# EAGLE design nandboard (EAGLE 7.7.0)
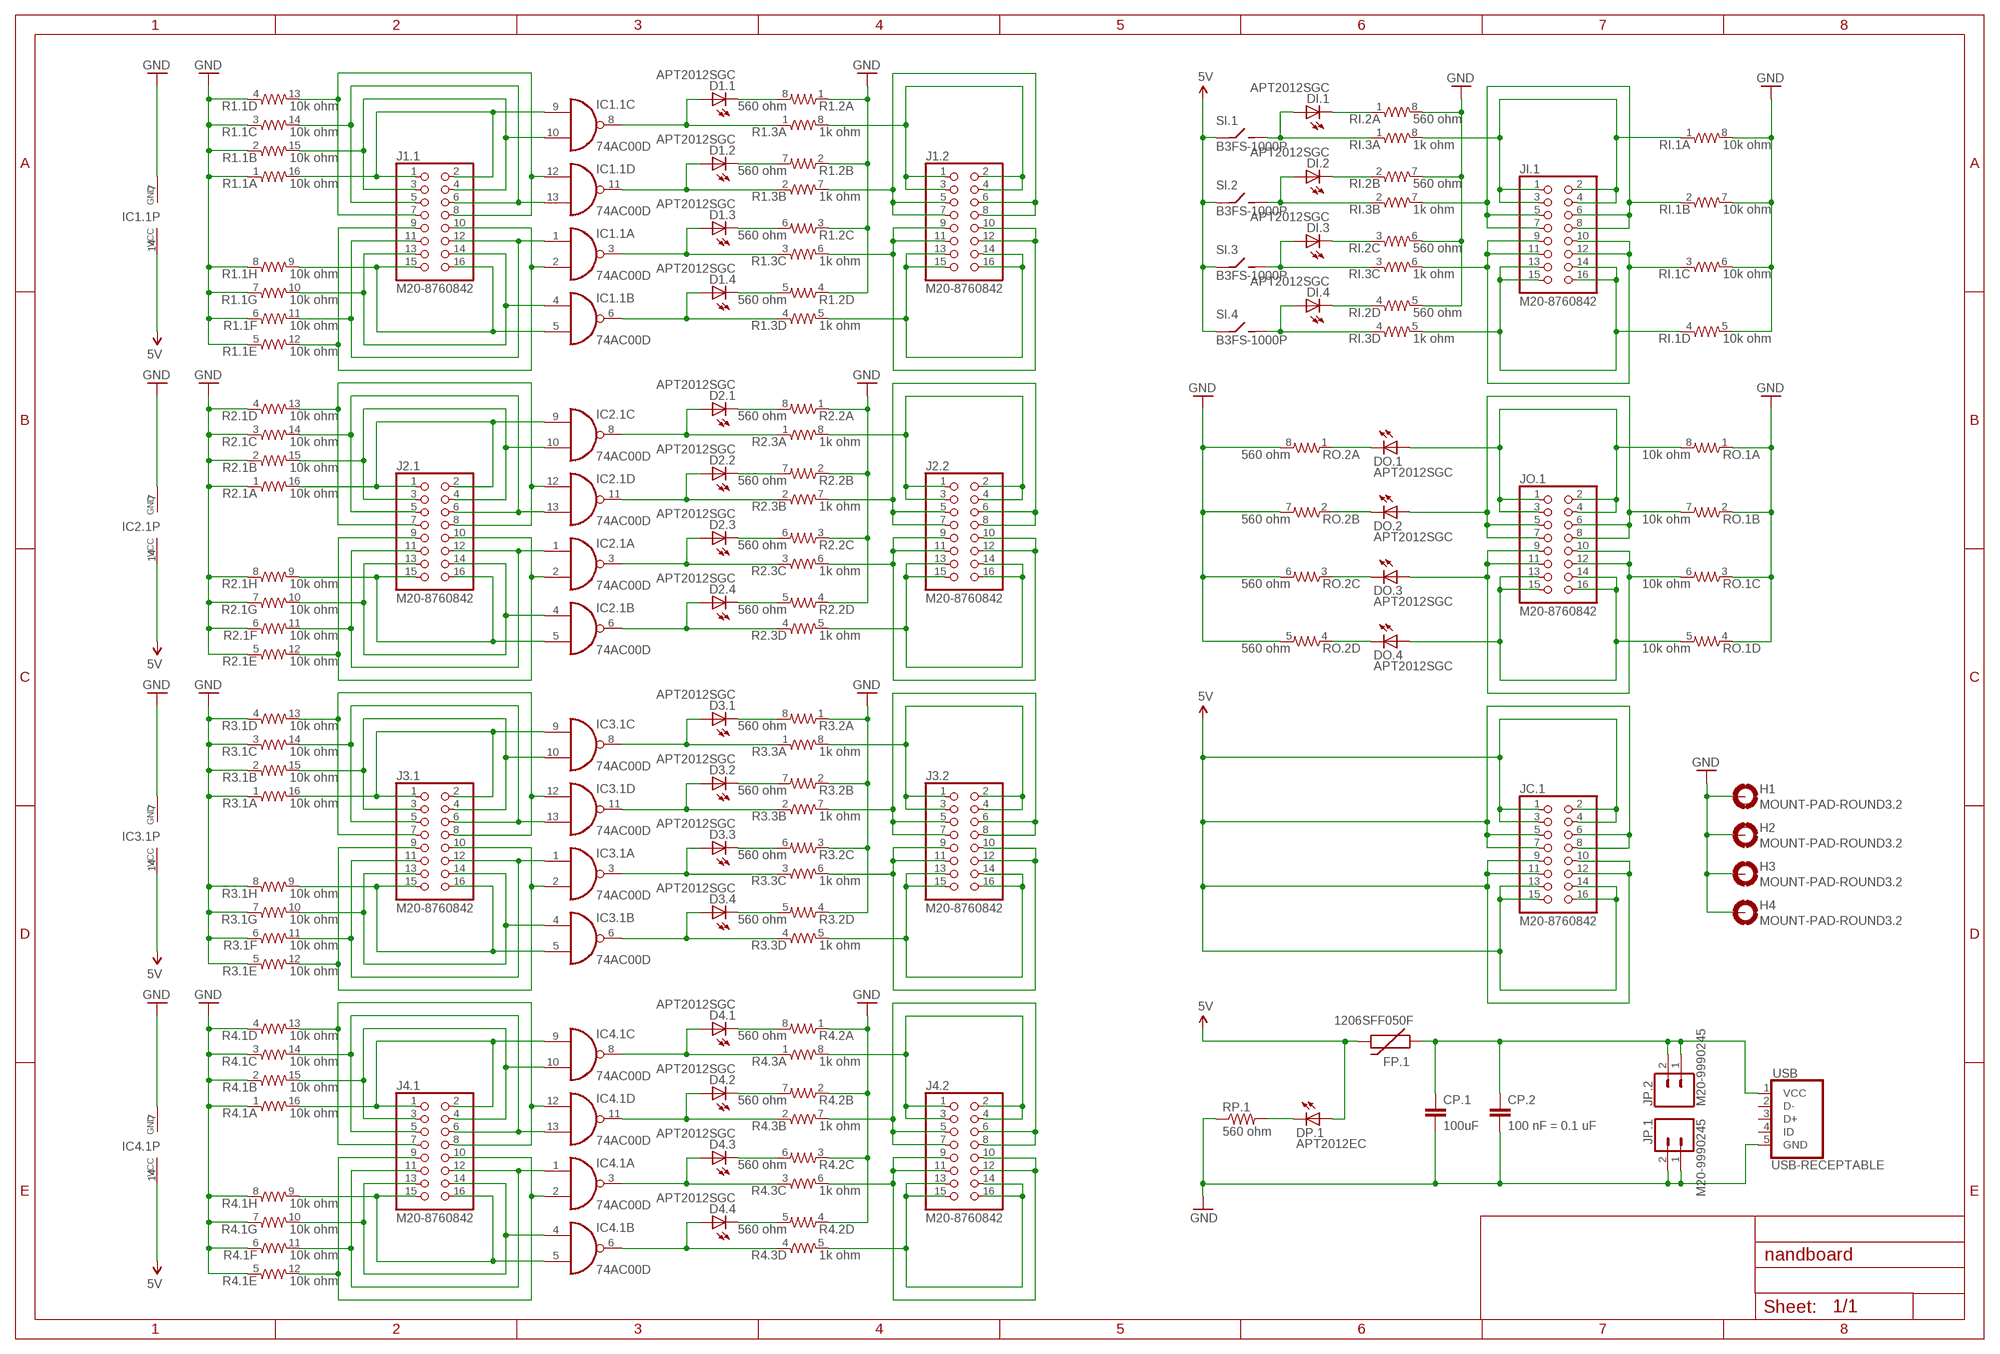
[diagram p0: schematic, sheet 1]

## Parts
CP.1  100uF  C-EUC1210  [C1210]
CP.2  100 nF = 0.1 uF  C-EUC0805  [C0805]
D1.1  APT2012SGC  LEDCHIPLED_0805  [CHIPLED_0805]
D1.2  APT2012SGC  LEDCHIPLED_0805  [CHIPLED_0805]
D1.3  APT2012SGC  LEDCHIPLED_0805  [CHIPLED_0805]
D1.4  APT2012SGC  LEDCHIPLED_0805  [CHIPLED_0805]
D2.1  APT2012SGC  LEDCHIPLED_0805  [CHIPLED_0805]
D2.2  APT2012SGC  LEDCHIPLED_0805  [CHIPLED_0805]
D2.3  APT2012SGC  LEDCHIPLED_0805  [CHIPLED_0805]
D2.4  APT2012SGC  LEDCHIPLED_0805  [CHIPLED_0805]
D3.1  APT2012SGC  LEDCHIPLED_0805  [CHIPLED_0805]
D3.2  APT2012SGC  LEDCHIPLED_0805  [CHIPLED_0805]
D3.3  APT2012SGC  LEDCHIPLED_0805  [CHIPLED_0805]
D3.4  APT2012SGC  LEDCHIPLED_0805  [CHIPLED_0805]
D4.1  APT2012SGC  LEDCHIPLED_0805  [CHIPLED_0805]
D4.2  APT2012SGC  LEDCHIPLED_0805  [CHIPLED_0805]
D4.3  APT2012SGC  LEDCHIPLED_0805  [CHIPLED_0805]
D4.4  APT2012SGC  LEDCHIPLED_0805  [CHIPLED_0805]
DI.1  APT2012SGC  LEDCHIPLED_0805  [CHIPLED_0805]
DI.2  APT2012SGC  LEDCHIPLED_0805  [CHIPLED_0805]
DI.3  APT2012SGC  LEDCHIPLED_0805  [CHIPLED_0805]
DI.4  APT2012SGC  LEDCHIPLED_0805  [CHIPLED_0805]
DO.1  APT2012SGC  LEDCHIPLED_0805  [CHIPLED_0805]
DO.2  APT2012SGC  LEDCHIPLED_0805  [CHIPLED_0805]
DO.3  APT2012SGC  LEDCHIPLED_0805  [CHIPLED_0805]
DO.4  APT2012SGC  LEDCHIPLED_0805  [CHIPLED_0805]
DP.1  APT2012EC  LEDCHIPLED_0805  [CHIPLED_0805]
FP.1  1206SFF050F  PTCSMD  [PTC-1206]
H1  MOUNT-PAD-ROUND3.2  [3,2-PAD]
H2  MOUNT-PAD-ROUND3.2  [3,2-PAD]
H3  MOUNT-PAD-ROUND3.2  [3,2-PAD]
H4  MOUNT-PAD-ROUND3.2  [3,2-PAD]
IC1.1  74AC00D  [SO14]
IC2.1  74AC00D  [SO14]
IC3.1  74AC00D  [SO14]
IC4.1  74AC00D  [SO14]
J1.1  M20-8760842  PINHD-2X8SMT  [2X08_SMT]
J1.2  M20-8760842  PINHD-2X8SMT  [2X08_SMT]
J2.1  M20-8760842  PINHD-2X8SMT  [2X08_SMT]
J2.2  M20-8760842  PINHD-2X8SMT  [2X08_SMT]
J3.1  M20-8760842  PINHD-2X8SMT  [2X08_SMT]
J3.2  M20-8760842  PINHD-2X8SMT  [2X08_SMT]
J4.1  M20-8760842  PINHD-2X8SMT  [2X08_SMT]
J4.2  M20-8760842  PINHD-2X8SMT  [2X08_SMT]
JC.1  M20-8760842  PINHD-2X8SMT  [2X08_SMT]
JI.1  M20-8760842  PINHD-2X8SMT  [2X08_SMT]
JO.1  M20-8760842  PINHD-2X8SMT  [2X08_SMT]
JP.1  M20-9990245  CONN_02  [1X02]
JP.2  M20-9990245  CONN_02  [1X02]
R1.1  10k ohm  742-16_S  [742-16]
R1.2  560 ohm  742-8_S  [742-8]
R1.3  1k ohm  742-8_S  [742-8]
R2.1  10k ohm  742-16_S  [742-16]
R2.2  560 ohm  742-8_S  [742-8]
R2.3  1k ohm  742-8_S  [742-8]
R3.1  10k ohm  742-16_S  [742-16]
R3.2  560 ohm  742-8_S  [742-8]
R3.3  1k ohm  742-8_S  [742-8]
R4.1  10k ohm  742-16_S  [742-16]
R4.2  560 ohm  742-8_S  [742-8]
R4.3  1k ohm  742-8_S  [742-8]
RI.1  10k ohm  742-8_S  [742-8]
RI.2  560 ohm  742-8_S  [742-8]
RI.3  1k ohm  742-8_S  [742-8]
RO.1  10k ohm  742-8_S  [742-8]
RO.2  560 ohm  742-8_S  [742-8]
RP.1  560 ohm  R-US_R0603  [R0603]
SI.1  B3FS-1000P  SPSTB3FS-1000  [B3FS-1000]
SI.2  B3FS-1000P  SPSTB3FS-1000  [B3FS-1000]
SI.3  B3FS-1000P  SPSTB3FS-1000  [B3FS-1000]
SI.4  B3FS-1000P  SPSTB3FS-1000  [B3FS-1000]
USB  USB-RECEPTABLE  [FCI-10103594-0001LF]

## Nets
5V: DP.1.A FP.1.2 IC1.1.14(P:VCC) IC2.1.14(P:VCC) IC3.1.14(P:VCC) IC4.1.14(P:VCC) JC.1.1 JC.1.2 JC.1.3 JC.1.4 JC.1.5 JC.1.6 JC.1.7 JC.1.8 JC.1.9 JC.1.10 JC.1.11 JC.1.12 JC.1.13 JC.1.14 JC.1.15 JC.1.16 SI.1.1(A) SI.1.2(A) SI.2.1(A) SI.2.2(A) SI.3.1(A) SI.3.2(A) SI.4.1(A) SI.4.2(A)
GND: CP.1.2 CP.2.2 H1.B3,2(MOUNT) H2.B3,2(MOUNT) H3.B3,2(MOUNT) H4.B3,2(MOUNT) IC1.1.7(P:GND) IC2.1.7(P:GND) IC3.1.7(P:GND) IC4.1.7(P:GND) JP.1.1 JP.1.2 R1.1.1 R1.1.2 R1.1.3 R1.1.4 R1.1.5 R1.1.6 R1.1.7 R1.1.8 R1.2.1 R1.2.2 R1.2.3 R1.2.4 R2.1.1 R2.1.2 R2.1.3 R2.1.4 R2.1.5 R2.1.6 R2.1.7 R2.1.8 R2.2.1 R2.2.2 R2.2.3 R2.2.4 R3.1.1 R3.1.2 R3.1.3 R3.1.4 R3.1.5 R3.1.6 R3.1.7 R3.1.8 R3.2.1 R3.2.2 R3.2.3 R3.2.4 R4.1.1 R4.1.2 R4.1.3 R4.1.4 R4.1.5 R4.1.6 R4.1.7 R4.1.8 R4.2.1 R4.2.2 R4.2.3 R4.2.4 RI.1.5 RI.1.6 RI.1.7 RI.1.8 RI.2.5 RI.2.6 RI.2.7 RI.2.8 RO.1.1 RO.1.2 RO.1.3 RO.1.4 RO.2.5 RO.2.6 RO.2.7 RO.2.8 RP.1.1 USB.5(GND)
N$1: IC2.1.9(C:I0) J2.1.1 J2.1.2 R2.1.16
N$2: IC2.1.10(C:I1) J2.1.3 J2.1.4 R2.1.15
N$3: JI.1.1 JI.1.2 JI.1.3 JI.1.4 RI.1.1 RI.3.8
N$4: IC2.1.13(D:I1) J2.1.5 J2.1.6 R2.1.14
N$5: IC2.1.12(D:I0) J2.1.7 J2.1.8 R2.1.13
N$6: JI.1.5 JI.1.6 JI.1.7 JI.1.8 RI.1.2 RI.3.7
N$7: JI.1.9 JI.1.10 JI.1.11 JI.1.12 RI.1.3 RI.3.6
N$8: JI.1.13 JI.1.14 JI.1.15 JI.1.16 RI.1.4 RI.3.5
N$9: IC2.1.5(B:I1) J2.1.15 J2.1.16 R2.1.9
N$10: IC2.1.4(B:I0) J2.1.13 J2.1.14 R2.1.10
N$11: IC2.1.1(A:I0) J2.1.11 J2.1.12 R2.1.11
N$12: IC2.1.2(A:I1) J2.1.9 J2.1.10 R2.1.12
N$13: D1.4.C R1.2.5
N$14: D2.1.C R2.2.8
N$15: D2.2.C R2.2.7
N$16: D1.2.C R1.2.7
N$17: J2.2.13 J2.2.14 J2.2.15 J2.2.16 R2.3.5
N$18: J2.2.9 J2.2.10 J2.2.11 J2.2.12 R2.3.6
N$19: J2.2.1 J2.2.2 J2.2.3 J2.2.4 R2.3.8
N$20: J2.2.5 J2.2.6 J2.2.7 J2.2.8 R2.3.7
N$21: IC1.1.9(C:I0) J1.1.1 J1.1.2 R1.1.16
N$22: IC1.1.10(C:I1) J1.1.3 J1.1.4 R1.1.15
N$23: IC1.1.13(D:I1) J1.1.5 J1.1.6 R1.1.14
N$24: IC1.1.12(D:I0) J1.1.7 J1.1.8 R1.1.13
N$25: J1.2.13 J1.2.14 J1.2.15 J1.2.16 R1.3.5
N$26: J1.2.9 J1.2.10 J1.2.11 J1.2.12 R1.3.6
N$27: D1.1.A IC1.1.8(C:O) R1.3.1
N$28: J1.2.1 J1.2.2 J1.2.3 J1.2.4 R1.3.8
N$29: IC1.1.5(B:I1) J1.1.15 J1.1.16 R1.1.9
N$30: IC1.1.4(B:I0) J1.1.13 J1.1.14 R1.1.10
N$31: IC1.1.1(A:I0) J1.1.11 J1.1.12 R1.1.11
N$32: IC1.1.2(A:I1) J1.1.9 J1.1.10 R1.1.12
N$33: D1.2.A IC1.1.11(D:O) R1.3.2
N$34: J1.2.5 J1.2.6 J1.2.7 J1.2.8 R1.3.7
N$35: D1.3.A IC1.1.3(A:O) R1.3.3
N$36: D1.4.A IC1.1.6(B:O) R1.3.4
N$37: D2.1.A IC2.1.8(C:O) R2.3.1
N$38: D2.2.A IC2.1.11(D:O) R2.3.2
N$39: D2.3.A IC2.1.3(A:O) R2.3.3
N$40: D2.4.A IC2.1.6(B:O) R2.3.4
N$41: D1.1.C R1.2.8
N$42: D1.3.C R1.2.6
N$43: D2.3.C R2.2.6
N$44: D2.4.C R2.2.5
N$45: IC3.1.9(C:I0) J3.1.1 J3.1.2 R3.1.16
N$46: IC3.1.10(C:I1) J3.1.3 J3.1.4 R3.1.15
N$47: IC3.1.13(D:I1) J3.1.5 J3.1.6 R3.1.14
N$48: IC3.1.12(D:I0) J3.1.7 J3.1.8 R3.1.13
N$49: IC3.1.5(B:I1) J3.1.15 J3.1.16 R3.1.9
N$50: IC3.1.4(B:I0) J3.1.13 J3.1.14 R3.1.10
N$51: IC3.1.1(A:I0) J3.1.11 J3.1.12 R3.1.11
N$52: IC3.1.2(A:I1) J3.1.9 J3.1.10 R3.1.12
N$53: J3.2.13 J3.2.14 J3.2.15 J3.2.16 R3.3.5
N$54: J3.2.9 J3.2.10 J3.2.11 J3.2.12 R3.3.6
N$55: J3.2.1 J3.2.2 J3.2.3 J3.2.4 R3.3.8
N$56: J3.2.5 J3.2.6 J3.2.7 J3.2.8 R3.3.7
N$57: D3.1.A IC3.1.8(C:O) R3.3.1
N$58: D3.2.A IC3.1.11(D:O) R3.3.2
N$59: D3.3.A IC3.1.3(A:O) R3.3.3
N$60: D3.4.A IC3.1.6(B:O) R3.3.4
N$61: D3.4.C R3.2.5
N$62: D3.3.C R3.2.6
N$63: D3.2.C R3.2.7
N$64: D3.1.C R3.2.8
N$65: IC4.1.9(C:I0) J4.1.1 J4.1.2 R4.1.16
N$66: IC4.1.10(C:I1) J4.1.3 J4.1.4 R4.1.15
N$67: IC4.1.13(D:I1) J4.1.5 J4.1.6 R4.1.14
N$68: IC4.1.12(D:I0) J4.1.7 J4.1.8 R4.1.13
N$69: IC4.1.5(B:I1) J4.1.15 J4.1.16 R4.1.9
N$70: IC4.1.4(B:I0) J4.1.13 J4.1.14 R4.1.10
N$71: IC4.1.1(A:I0) J4.1.11 J4.1.12 R4.1.11
N$72: IC4.1.2(A:I1) J4.1.9 J4.1.10 R4.1.12
N$73: J4.2.13 J4.2.14 J4.2.15 J4.2.16 R4.3.5
N$74: J4.2.9 J4.2.10 J4.2.11 J4.2.12 R4.3.6
N$75: J4.2.1 J4.2.2 J4.2.3 J4.2.4 R4.3.8
N$76: J4.2.5 J4.2.6 J4.2.7 J4.2.8 R4.3.7
N$77: D4.1.A IC4.1.8(C:O) R4.3.1
N$78: D4.2.A IC4.1.11(D:O) R4.3.2
N$79: D4.3.A IC4.1.3(A:O) R4.3.3
N$80: D4.4.A IC4.1.6(B:O) R4.3.4
N$81: D4.1.C R4.2.8
N$82: D4.2.C R4.2.7
N$83: D4.3.C R4.2.6
N$84: D4.4.C R4.2.5
N$85: DO.1.C RO.2.1
N$86: DO.2.C RO.2.2
N$87: DO.3.C RO.2.3
N$88: DO.4.C RO.2.4
N$89: DO.1.A JO.1.1 JO.1.2 JO.1.3 JO.1.4 RO.1.8
N$90: DO.2.A JO.1.5 JO.1.6 JO.1.7 JO.1.8 RO.1.7
N$91: DO.3.A JO.1.9 JO.1.10 JO.1.11 JO.1.12 RO.1.6
N$92: DO.4.A JO.1.13 JO.1.14 JO.1.15 JO.1.16 RO.1.5
N$93: CP.1.1 CP.2.1 FP.1.1 JP.2.1 JP.2.2 USB.1(VCC)
N$94: DI.2.A RI.3.2 SI.2.3(B) SI.2.4(B)
N$95: DI.3.A RI.3.3 SI.3.3(B) SI.3.4(B)
N$96: DI.1.A RI.3.1 SI.1.3(B) SI.1.4(B)
N$97: DI.4.A RI.3.4 SI.4.3(B) SI.4.4(B)
N$98: DI.1.C RI.2.1
N$99: DI.2.C RI.2.2
N$100: DI.3.C RI.2.3
N$101: DI.4.C RI.2.4
N$102: DP.1.C RP.1.2
Unconnected: USB.2(D-) USB.3(D+) USB.4(ID)

## Library data of the parts
CP.1 CP.2 = rcl:C-EU: CAPACITOR, European symbol
D1.1-D1.4 D2.1-D2.4 D3.1-D3.4 D4.1-D4.4 DI.1-DI.4 DO.1-DO.4 DP.1 = led:LED: LED OSRAM: - CHIPLED LG R971, LG N971, LY N971, LG Q971, LY Q971, LO R971, LY R971 LH N974, LH R974 LS Q976, LO Q976, LY Q976 LO Q996 - Hyper CHIPLED LW Q18S LB Q993, LB Q99A, LB R99A - SideLED LS A670, LO A670, LY A670, LG A670, LP A670 LB A673, LV A673, LT A673, LW A673 LH A674 LY A675 LS A676, LA A676, LO A676, LY A676, LW A676 LS A679, LY A679, LG A679 - Hyper Micro SIDELED® LS Y876, LA Y876, LO Y876, LY Y876 LT Y87S - SmartLED LW L88C, LW L88S LB L89C, LB L89S, LG L890 LS L89K, LO L89K, LY L89K LS L896, LA L896, LO L896, LY L896 - TOPLED LS T670, LO T670, LY T670, LG T670, LP T670 LSG T670, LSP T670, LSY T670, LOP T670, LYG T670 LG T671, LOG T671, LSG T671 LB T673, LV T673, LT T673, LW T673 LH T674 LS T676, LA T676, LO T676, LY T676, LB T676, LH T676, LSB T676, LW T676 LB T67C, LV T67C, LT T67C, LS T67K, LO T67K, LY T67K, LW E67C LS E67B, LA E67B, LO E67B, LY E67B, LB E67C, LV E67C, LT E67C LW T67C LS T679, LY T679, LG T679 LS T770, LO T770, LY T770, LG T770, LP T770 LB T773, LV T773, LT T773, LW T773 LH T774 LS E675, LA E675, LY E675, LS T675 LS T776, LA T776, LO T776, LY T776, LB T776 LHGB T686 LT T68C, LB T68C - Hyper Mini TOPLED® LB M676 - Mini TOPLED Santana® LG M470 LS M47K, LO M47K, LY M47K Source: http://www.osram.convergy.de LUXEON: - LUMILED® LXK2-PW12-R00, LXK2-PW12-S00, LXK2-PW14-U00, LXK2-PW14-V00 LXK2-PM12-R00, LXK2-PM12-S00, LXK2-PM14-U00 LXK2-PE12-Q00, LXK2-PE12-R00, LXK2-PE12-S00, LXK2-PE14-T00, LXK2-PE14-U00 LXK2-PB12-K00, LXK2-PB12-L00, LXK2-PB12-M00, LXK2-PB14-N00, LXK2-PB14-P00, LXK2-PB14-Q00 LXK2-PR12-L00, LXK2-PR12-M00, LXK2-PR14-Q00, LXK2-PR14-R00 LXK2-PD12-Q00, LXK2-PD12-R00, LXK2-PD12-S00 LXK2-PH12-R00, LXK2-PH12-S00 LXK2-PL12-P00, LXK2-PL12-Q00, LXK2-PL12-R00 Source: www.luxeon.com KINGBRIGHT: KA-3528ASYC Source: www.kingbright.com
FP.1 = SparkFun-PowerIC:PTC: Resettable Fuse PTC Resettable Fuse. Spark Fun Electronics SKU : COM-08357; PROD_ID: RES-11150
H1-H4 = holes:MOUNT-PAD-ROUND: MOUNTING PAD, round
IC1.1 IC2.1 IC3.1 IC4.1 = 74xx-eu:74*00: Quad 2-input NAND gate
J1.1 J1.2 J2.1 J2.2 J3.1 J3.2 J4.1 J4.2 JC.1 JI.1 JO.1 = pinhead+:PINHD-2X8: PIN HEADER
JP.1 JP.2 = SparkFun-Connectors:CONN_02: Multi connection point. Often used as Generic Header-pin footprint for 0.1 inch spaced/style header connections On any of the 0.1 inch spaced packages, you can populate with these: Break Away Headers - Straight <https://www.sparkfun.com/products/116> (PRT-00116) Break Away Male Headers - Right Angle <https://www.sparkfun.com/products/553> (PRT-00553) Female Headers <https://www.sparkfun.com/products/115> (PRT-00115) Break Away Headers - Machine Pin <https://www.sparkfun.com/products/117> (PRT-00117) Break Away Female Headers - Swiss Machine Pin <https://www.sparkfun.com/products/743> (PRT-00743) For SCREWTERMINALS and SPRING TERMINALS visit here: Screw Terimnals on SparkFun.com <https://www.sparkfun.com/search/results?term=Screw+Terminals> (5mm/3.5mm/2.54mm spacing) This device is also useful as a general connection point to wire up your design to another part of your project. Our various solder wires solder well into these plated through hole pads. Hook-Up Wire - Assortment (Stranded, 22 AWG) <https://www.sparkfun.com/products/11375> (PRT-11375) Hook-Up Wire - Assortment (Solid Core, 22 AWG) <https://www.sparkfun.com/products/11367> (PRT-11367) View the entire wire category on our website here <https://www.sparkfun.com/categories/141> Special notes: Molex polarized connector foot print use with: PRT-08233 with associated crimp pins and housings. 2.54_SCREWTERM for use with PRT-10571. 3.5mm Screw Terminal footprints for PRT-08084 5mm Screw Terminal footprints for use with PRT-08432
R1.1 R2.1 R3.1 R4.1 = resistor-array:742-16_S: CTS 742 Series 16 Terminations, 8 Resistors
R1.2 R1.3 R2.2 R2.3 R3.2 R3.3 R4.2 R4.3 RI.1-RI.3 RO.1 RO.2 = resistor-array:742-8_S: CTS 742 Series 8 Terminations, 4 Resistors
RP.1 = resistor:R-US_: RESISTOR, American symbol
SI.1-SI.4 = PP_Electromechanical:SPST: SPST Switches
USB = daspilker:USB-RECEPTABLE: USB Receptable

## Board
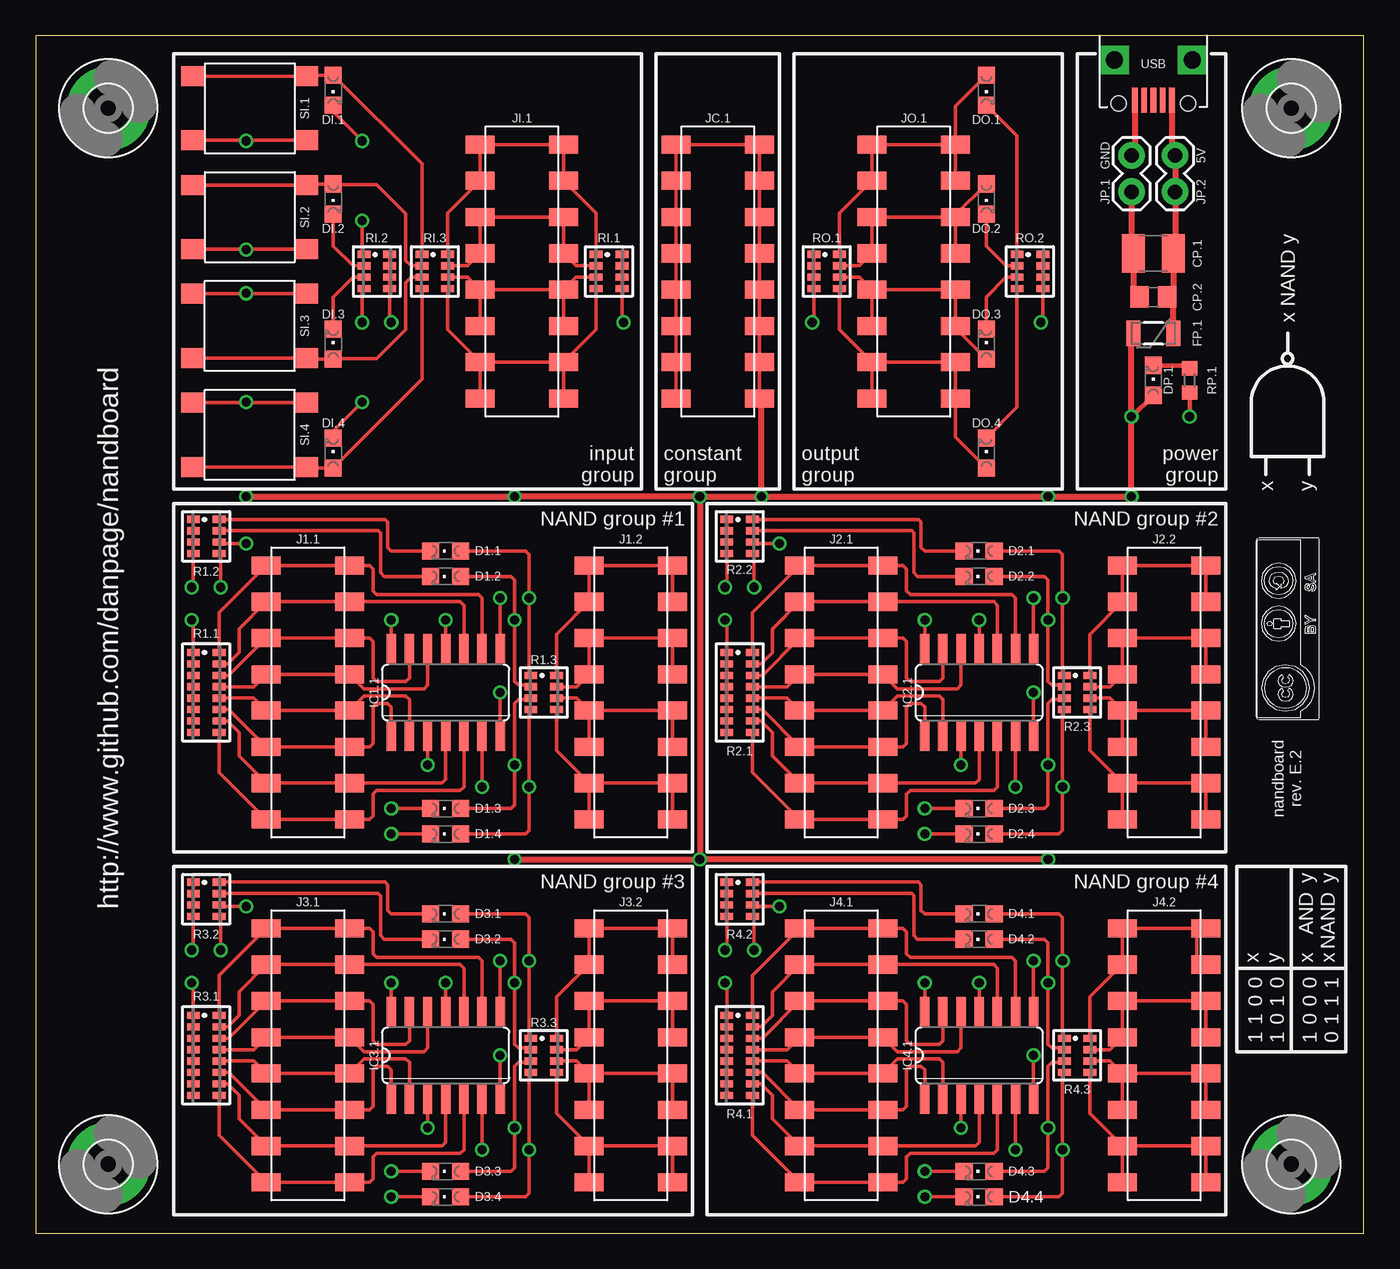
[diagram p1: board, top side]
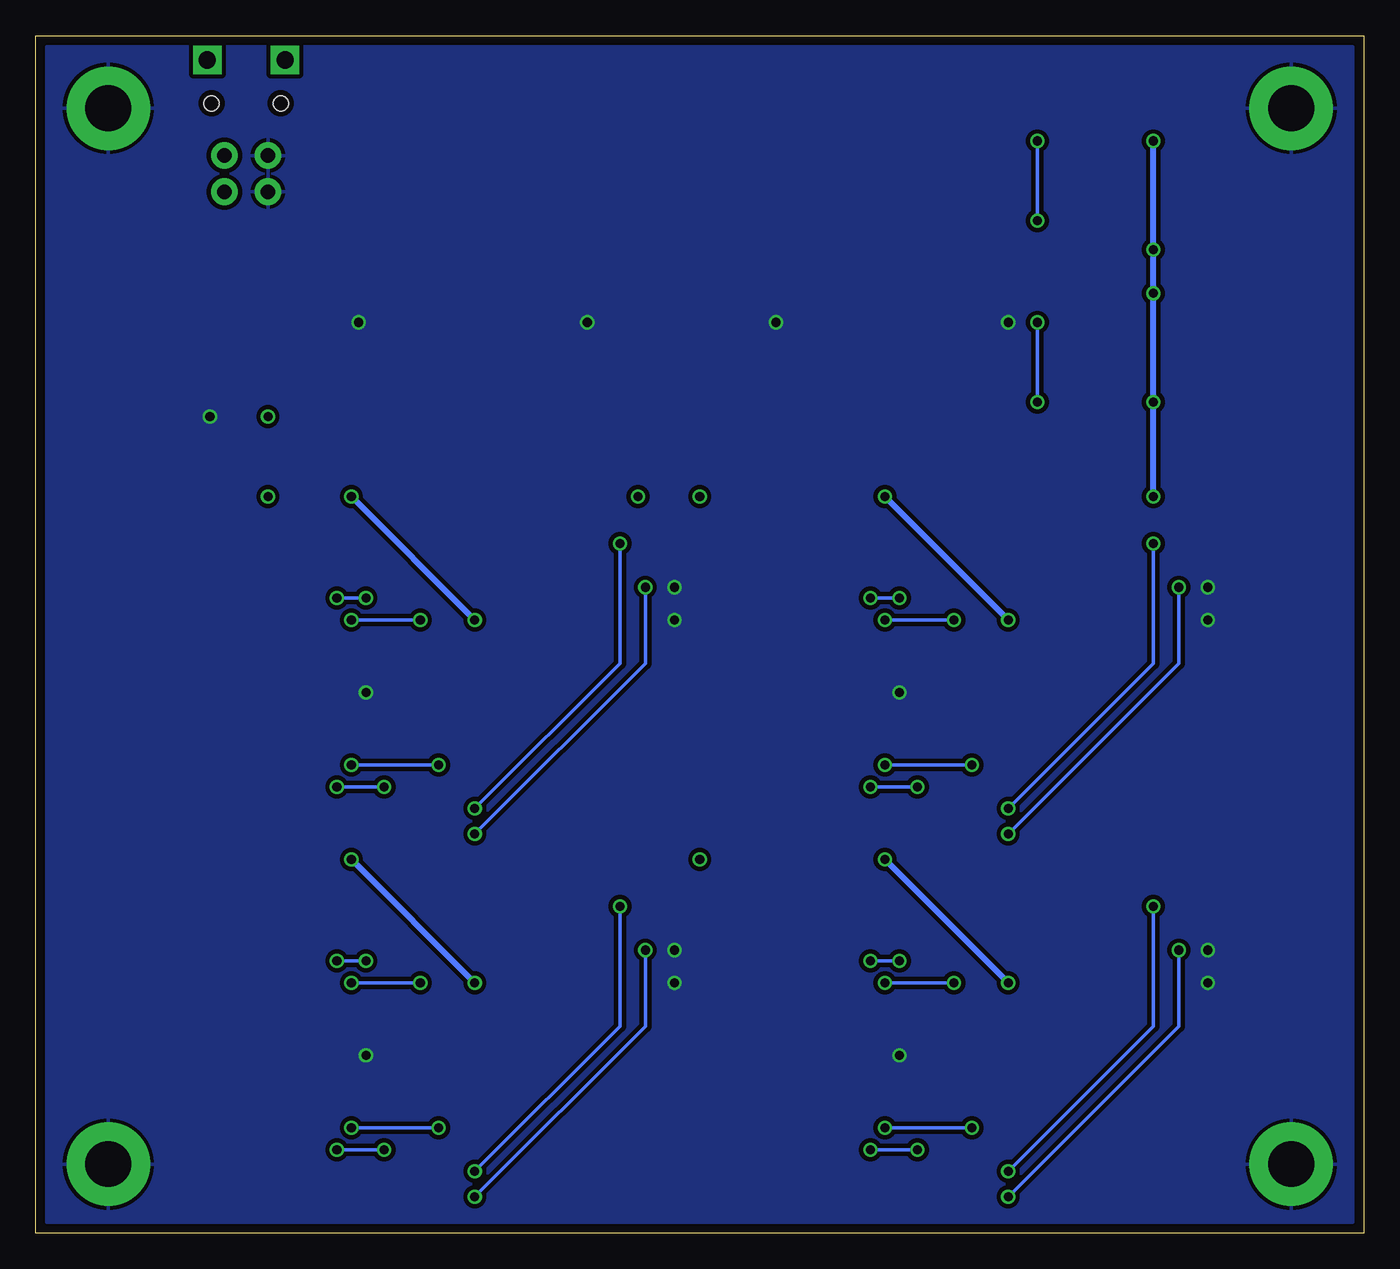
[diagram p2: board, bottom side, seen from below]

Size 92.96 x 83.82 mm. Coordinates in mm from the lower left corner, seen from the top.
Outline: 0,0 92.96,0 92.96,83.82 0,83.82 0,0
Copper layers (1*16): Top 0.0356mm / dielectric 1.5011mm / Bottom 0.0356mm
Design rules "oshpark-2layer": minimum track width 6mil, minimum drill 13mil, track to track 6mil, track to pad 6mil, pad to pad 6mil, via to via 6mil, smd to smd 6mil, copper to edge 15mil, drill to drill 6mil, minimum pad ring 7mil, minimum via ring 7mil, stop-mask expansion 2.5mil, vias tented up to drill 0mil, thermal gap 10mil

### Footprints (pad centres in the part's own frame; a part is rotated, then mirrored left to right if it is on the bottom)
C1210 = smd 1.6 x 2.7: 1 -1.4,0; 2 1.4,0
C0805 = smd 1.3 x 1.5: 1 -0.95,0; 2 0.95,0
CHIPLED_0805 = smd 1.2 x 1.2: A 0,-1.05; C 0,1.05
PTC-1206 = smd 1 x 1.8: 1 -1.4,0; 2 1.4,0
3,2-PAD = drill 3.2 pad 5.842: B3,2 0,0
SO14 = smd 0.66 x 2.032: 1 -3.81,-3.073; 2 -2.54,-3.073; 3 -1.27,-3.073; 4 0,-3.073; 5 1.27,-3.073; 6 2.54,-3.073; 7 3.81,-3.073; 8 3.81,3.073; 9 2.54,3.073; 10 1.27,3.073; 11 0,3.073; 12 -1.27,3.073; 13 -2.54,3.073; 14 -3.81,3.073
2X08_SMT = smd 1.27 x 2.032: 1 -8.89,-2.921; 2 -8.89,2.921; 3 -6.35,-2.921; 4 -6.35,2.921; 5 -3.81,-2.921; 6 -3.81,2.921; 7 -1.27,-2.921; 8 -1.27,2.921; 9 1.27,-2.921; 10 1.27,2.921; 11 3.81,-2.921; 12 3.81,2.921; 13 6.35,-2.921; 14 6.35,2.921; 15 8.89,-2.921; 16 8.89,2.921
1X02 = drill 1.016 pad 1.88: 1 0,0; 2 2.54,0
742-16 = smd 0.5 x 0.9: 1 -2.8,-0.9; 2 -2,-0.9; 3 -1.2,-0.9; 4 -0.4,-0.9; 5 0.4,-0.9; 6 1.2,-0.9; 7 2,-0.9; 8 2.8,-0.9; 9 2.8,0.9; 10 2,0.9; 11 1.2,0.9; 12 0.4,0.9; 13 -0.4,0.9; 14 -1.2,0.9; 15 -2,0.9; 16 -2.8,0.9
742-8 = smd 0.5 x 0.9: 1 -1.2,-0.9; 2 -0.4,-0.9; 3 0.4,-0.9; 4 1.2,-0.9; 5 1.2,0.9; 6 0.4,0.9; 7 -0.4,0.9; 8 -1.2,0.9
R0603 = smd 1 x 1.1: 1 -0.85,0; 2 0.85,0
B3FS-1000 = smd 1.6 x 1.4: 1 4,-2.25; 2 -4,-2.25; 3 4,2.25; 4 -4,2.25
FCI-10103594-0001LF = smd 0.4 x 1.75: 1 -1.3,4.525; 2 -0.65,4.525; 3 0,4.525; 4 0.65,4.525; 5 1.3,4.525 | drill 1.2 pad 2 square: P$3 -2.725,1.7; P$4 2.725,1.7 | hole 1.05: -2.425,4.73; 2.425,4.73

### Placement (x,y rotation side)
CP.1  78.23,68.58 180 top
CP.2  78.23,65.53 180 top
D1.1  28.7,47.75 90 top
D1.2  28.7,45.97 90 top
D1.3  28.7,29.72 90 top
D1.4  28.7,27.94 90 top
D2.1  66.04,47.75 90 top
D2.2  66.04,45.97 90 top
D2.3  66.04,29.72 90 top
D2.4  66.04,27.94 90 top
D3.1  28.7,22.35 90 top
D3.2  28.7,20.57 90 top
D3.3  28.7,4.32 90 top
D3.4  28.7,2.54 90 top
D4.1  66.04,22.35 90 top
D4.2  66.04,20.57 90 top
D4.3  66.04,4.32 90 top
D4.4  66.04,2.54 90 top
DI.1  20.83,80.01 180 top
DI.2  20.83,72.39 180 top
DI.3  20.83,62.23 0 top
DI.4  20.83,54.61 0 top
DO.1  66.55,80.01 180 top
DO.2  66.55,72.39 180 top
DO.3  66.55,62.23 0 top
DO.4  66.55,54.61 0 top
DP.1  78.23,59.69 0 top
FP.1  78.23,62.99 180 top
H1  5.08,4.83 0 top
H2  5.08,78.74 0 top
H3  87.88,4.83 0 top
H4  87.88,78.74 0 top
IC1.1  28.7,37.85 0 top
IC2.1  66.04,37.85 0 top
IC3.1  28.7,12.45 0 top
IC4.1  66.04,12.45 0 top
J1.1  19.05,37.85 270 top
J1.2  41.66,37.85 270 top
J2.1  56.39,37.85 270 top
J2.2  78.99,37.85 270 top
J3.1  19.05,12.45 270 top
J3.2  41.66,12.45 270 top
J4.1  56.39,12.45 270 top
J4.2  78.99,12.45 270 top
JC.1  47.75,67.31 270 top
JI.1  34.04,67.31 270 top
JO.1  61.47,67.31 270 top
JP.1  76.71,72.9 90 top
JP.2  79.76,72.9 90 top
R1.1  11.94,37.85 270 top
R1.2  11.94,48.77 270 top
R1.3  35.56,37.85 270 top
R2.1  49.28,37.85 270 top
R2.2  49.28,48.77 270 top
R2.3  72.9,37.85 270 top
R3.1  11.94,12.45 270 top
R3.2  11.94,23.37 270 top
R3.3  35.56,12.45 270 top
R4.1  49.28,12.45 270 top
R4.2  49.28,23.37 270 top
R4.3  72.9,12.45 270 top
RI.1  40.13,67.31 270 top
RI.2  23.88,67.31 270 top
RI.3  27.94,67.31 270 top
RO.1  55.37,67.31 270 top
RO.2  69.6,67.31 270 top
RP.1  80.77,59.69 90 top
SI.1  14.99,78.74 0 top
SI.2  14.99,71.12 0 top
SI.3  14.99,63.5 180 top
SI.4  14.99,55.88 180 top
USB  78.23,83.82 180 top

### Tracks (layer width: path | path; a pad name or v marks a point on that pad's centre or on a via)
5V  (via drill 0.64)
  Top 0.254: IC3.1.14 v24.89,17.53 | SI.4.1 SI.4.2 15.02,58.13 v14.73,58.17 | SI.3.1 14.95,65.75 v14.73,65.79 15.02,65.75 SI.3.2 | SI.2.2 14.95,68.87 v14.73,68.83 15.02,68.87 SI.2.1 | SI.1.2 14.95,76.49 v14.73,76.45 15.02,76.49 SI.1.1 | IC1.1.14 v24.89,42.93 | IC2.1.14 v62.23,42.93 | IC4.1.14 v62.23,17.53 | JC.1.15 JC.1.13 JC.1.11 JC.1.9 JC.1.7 JC.1.5 JC.1.3 JC.1.1 JC.1.2 JC.1.4 JC.1.6 JC.1.8 JC.1.10 JC.1.12 JC.1.14 JC.1.16
  Top 0.305: v76.71,57.15 76.74,57.15 DP.1.A
  Top 0.406: v70.87,26.16 v46.48,26.16 | v33.53,26.16 v46.48,26.16 | v46.48,51.56 v46.48,26.16 | v46.48,51.56 v50.8,51.56 | v46.48,51.56 v33.53,51.56 v14.73,51.56 | v50.8,51.56 50.8,58.29 JC.1.16 | v50.8,51.56 v70.87,51.56 76.71,51.56 v76.71,57.15 76.71,62.87 FP.1.2
  Bottom 0.406: v70.87,26.16 v62.23,17.53 | v14.73,76.45 v14.73,68.83 v14.73,65.79 v14.73,58.17 v14.73,51.56 | v24.89,42.93 v33.53,51.56 | v24.89,17.53 v33.53,26.16 | v62.23,42.93 v70.87,51.56
GND  (via drill 0.64)
  Top 0.254: R4.2.1 R4.2.2 R4.2.3 R4.2.4 48.38,19.93 v48.26,19.81 | R4.1.8 R4.1.7 R4.1.6 R4.1.5 R4.1.4 R4.1.3 R4.1.2 R4.1.1 48.38,17.41 v48.26,17.53 | IC4.1.7 v69.85,12.45 | IC3.1.7 v32.51,12.45 | R3.1.8 R3.1.7 R3.1.6 R3.1.5 R3.1.4 R3.1.3 R3.1.2 R3.1.1 11.04,17.41 v10.92,17.53 | R3.2.1 R3.2.2 R3.2.3 R3.2.4 11.04,19.93 v10.92,19.81 | R2.1.8 R2.1.7 R2.1.6 R2.1.5 R2.1.4 R2.1.3 R2.1.2 R2.1.1 | R2.1.1 48.26,40.65 | IC2.1.7 v69.85,37.85 | IC1.1.7 v32.51,37.85 | R1.1.8 R1.1.7 R1.1.6 R1.1.5 R1.1.4 R1.1.3 R1.1.2 R1.1.1 11.04,42.81 v10.92,42.93 | v10.92,45.21 11.04,45.33 R1.2.4 R1.2.3 R1.2.2 R1.2.1 | R2.1.1 48.38,42.81 v48.26,42.93 | v24.89,63.75 24.78,63.87 RI.2.5 RI.2.6 RI.2.7 RI.2.8 | v41.15,63.75 41.03,63.87 RI.1.5 RI.1.6 RI.1.7 RI.1.8 | RO.1.1 RO.1.2 RO.1.3 RO.1.4 54.47,63.87 v54.36,63.75 | RO.2.8 RO.2.7 RO.2.6 RO.2.5 70.5,63.89 v70.36,63.75 | R2.2.1 R2.2.2 R2.2.3 R2.2.4 48.38,45.33 v48.26,45.21
  Top 0.305: RP.1.1 v80.77,57.15
  Top 0.406: 76.96,68.71 CP.1.2 | CP.1.2 76.83,65.98 CP.2.2 | USB.5 76.93,75.66 JP.1.2 | JP.1.1 76.71,68.7 CP.1.2
  pour Bottom (isolate 0.305): 0.76,0.76 0.76,83.06 92.2,83.06 92.2,0.76
N$1
  Top 0.254: IC2.1.9 68.58,44.45 68.33,44.7 61.21,44.7 60.96,44.96 60.96,46.48 60.71,46.74 J2.1.2 J2.1.1 50.18,43.45 R2.1.16
N$2
  Top 0.254: IC2.1.10 67.31,43.94 67.06,44.2 J2.1.4 J2.1.3 51.56,42.29 51.56,40.64 50.77,39.85 R2.1.15
N$3
  Top 0.254: RI.1.1 39.23,71.39 JI.1.4 JI.1.2 JI.1.1 JI.1.3 28.84,71.39 RI.3.8
N$4
  Top 0.254: IC2.1.13 63.5,38.86 63.25,38.61 61.21,38.61 60.96,38.86 60.96,41.4 60.71,41.66 J2.1.6 J2.1.5 50.86,39.05 R2.1.14
N$5
  Top 0.254: IC2.1.12 64.77,38.35 64.52,38.1 60.33,38.1 J2.1.8 J2.1.7 52.6,38.25 R2.1.13
N$6
  Top 0.254: RI.1.2 37.83,67.71 JI.1.8 JI.1.6 JI.1.5 JI.1.7 30.25,67.71 RI.3.7
N$7
  Top 0.254: JI.1.11 JI.1.9 | JI.1.9 JI.1.10 | JI.1.12 JI.1.10 | RI.1.3 37.83,66.91 JI.1.10 | RI.3.6 30.25,66.91 JI.1.9
N$8
  Top 0.254: JI.1.16 JI.1.14 | JI.1.14 JI.1.13 | JI.1.13 JI.1.15 | RI.1.4 39.23,63.23 JI.1.14 | RI.3.5 28.84,63.23 JI.1.13
N$9
  Top 0.254: IC2.1.5 67.31,31.24 67.06,30.99 61.21,30.99 60.96,30.73 60.96,29.21 60.71,28.96 J2.1.16 J2.1.15 50.18,32.25 R2.1.9
N$10
  Top 0.254: IC2.1.4 66.04,31.75 65.79,31.5 J2.1.14 J2.1.13 51.56,33.4 51.56,35.05 50.77,35.85 R2.1.10
N$11
  Top 0.254: IC2.1.1 62.23,36.83 61.98,37.08 61.21,37.08 60.96,36.83 60.96,34.29 60.71,34.04 J2.1.12 J2.1.11 50.86,36.65 R2.1.11
N$12
  Top 0.254: IC2.1.2 63.5,37.34 63.25,37.59 60.33,37.59 J2.1.10 J2.1.9 52.6,37.45 R2.1.12
N$13  (via drill 0.64)
  Top 0.254: v12.95,45.21 12.95,47.45 R1.2.5 | v24.89,27.94 D1.4.C
  Bottom 0.254: v24.89,27.94 12.95,39.88 v12.95,45.21
N$14
  Top 0.254: R2.2.8 61.79,49.97 61.98,49.78 61.98,48.01 62.23,47.75 D2.1.C
N$15
  Top 0.254: R2.2.7 61.32,49.17 61.47,49.02 61.47,46.23 61.72,45.97 D2.2.C
N$16
  Top 0.254: R1.2.7 23.98,49.17 24.13,49.02 24.13,46.23 24.38,45.97 D1.2.C
N$17
  Top 0.254: J2.2.16 J2.2.14 J2.2.13 | J2.2.13 J2.2.15 | R2.3.5 73.8,33.77 J2.2.13
N$18
  Top 0.254: J2.2.12 J2.2.10 J2.2.9 | J2.2.9 J2.2.11 | R2.3.6 75.2,37.45 J2.2.9
N$19
  Top 0.254: J2.2.4 J2.2.2 J2.2.1 J2.2.3 73.8,41.92 R2.3.8
N$20
  Top 0.254: J2.2.8 J2.2.6 J2.2.5 J2.2.7 75.2,38.25 R2.3.7
N$21
  Top 0.254: IC1.1.9 31.24,44.45 30.99,44.7 23.88,44.7 23.62,44.96 23.62,46.48 23.37,46.74 J1.1.2 J1.1.1 12.84,43.45 R1.1.16
N$22
  Top 0.254: IC1.1.10 29.97,43.94 29.72,44.2 J1.1.4 J1.1.3 14.22,42.29 14.22,40.64 13.43,39.85 R1.1.15
N$23
  Top 0.254: 22.61,41.66 J1.1.6 J1.1.5 13.52,39.05 R1.1.14 | 22.61,41.66 22.61,41.4 | IC1.1.13 26.16,38.86 25.91,38.61 23.88,38.61 23.62,38.86 23.62,41.4 23.37,41.66 22.61,41.66
N$24
  Top 0.254: IC1.1.12 27.43,38.35 27.18,38.1 22.99,38.1 J1.1.8 J1.1.7 15.26,38.25 R1.1.13
N$25
  Top 0.254: J1.2.15 J1.2.13 | J1.2.13 J1.2.14 J1.2.16 | R1.3.5 36.46,33.77 J1.2.13
N$26
  Top 0.254: J1.2.11 J1.2.9 | J1.2.9 J1.2.10 J1.2.12 | R1.3.6 37.87,37.45 J1.2.9
N$27  (via drill 0.64)
  Top 0.254: IC1.1.8 v32.51,44.45 | D1.1.A 34.29,47.75 34.54,47.5 v34.54,44.45 34.54,39.16 R1.3.1
  Bottom 0.254: v32.51,44.45 v34.54,44.45
N$28
  Top 0.254: J1.2.4 J1.2.2 J1.2.1 J1.2.3 36.46,41.92 R1.3.8
N$29
  Top 0.254: IC1.1.5 29.97,31.24 29.72,30.99 23.88,30.99 23.62,30.73 23.62,29.21 23.37,28.96 J1.1.16 J1.1.15 12.84,32.25 R1.1.9
N$30
  Top 0.254: IC1.1.4 28.7,31.75 28.45,31.5 J1.1.14 J1.1.13 14.22,33.4 14.22,35.05 13.43,35.85 R1.1.10
N$31
  Top 0.254: J1.1.12 J1.1.11 13.52,36.65 R1.1.11 | J1.1.12 22.35,34.04 | IC1.1.1 24.89,36.83 24.64,37.08 23.88,37.08 23.62,36.83 23.62,34.29 23.37,34.04 J1.1.12
N$32
  Top 0.254: IC1.1.2 26.16,37.34 25.91,37.59 22.99,37.59 J1.1.10 J1.1.9 15.26,37.45 R1.1.12
N$33  (via drill 0.64)
  Top 0.254: IC1.1.11 v28.7,42.93 | D1.2.A 33.27,45.97 33.53,45.72 v33.53,42.93 33.53,38.61 33.78,38.35 34.55,38.35 R1.3.2
  Bottom 0.254: v28.7,42.93 v33.53,42.93
N$34
  Top 0.254: J1.2.8 J1.2.6 J1.2.5 J1.2.7 37.87,38.25 R1.3.7
N$35  (via drill 0.64)
  Top 0.254: IC1.1.3 v27.43,32.77 | 29.88,29.72 D1.3.A 33.27,29.72 33.53,29.97 v33.53,32.77 33.53,37.08 33.78,37.34 34.55,37.34 R1.3.3
  Bottom 0.254: v27.43,32.77 v33.53,32.77
N$36  (via drill 0.64)
  Top 0.254: IC1.1.6 v31.24,31.24 | R1.3.4 34.53,36.52 34.53,31.51 v34.54,31.24 34.54,28.19 34.29,27.94 D1.4.A
  Bottom 0.254: v31.24,31.24 v34.54,31.24
N$37  (via drill 0.64)
  Top 0.254: IC2.1.8 v69.85,44.45 | 71.87,44.18 v71.88,44.45 | v71.88,44.45 71.88,47.5 71.63,47.75 D2.1.A | v71.88,44.45 71.88,39.16 R2.3.1
  Bottom 0.254: v69.85,44.45 v71.88,44.45
N$38  (via drill 0.64)
  Top 0.254: IC2.1.11 v66.04,42.93 | D2.2.A 70.61,45.97 70.87,45.72 v70.87,42.93 70.87,38.61 71.12,38.35 71.89,38.35 R2.3.2
  Bottom 0.254: v66.04,42.93 v70.87,42.93
N$39  (via drill 0.64)
  Top 0.254: IC2.1.3 v64.77,32.77 | D2.3.A 70.61,29.72 70.87,29.97 v70.87,32.77 70.87,37.08 71.12,37.34 71.89,37.34 R2.3.3
  Bottom 0.254: v64.77,32.77 v70.87,32.77
N$40  (via drill 0.64)
  Top 0.254: IC2.1.6 v68.58,31.24 | D2.4.A 71.63,27.94 71.88,28.19 v71.88,31.24 71.88,36.53 R2.3.4
  Bottom 0.254: v68.58,31.24 v71.88,31.24
N$41
  Top 0.254: R1.2.8 24.45,49.97 24.64,49.78 24.64,48.01 24.89,47.75 D1.1.C
N$42  (via drill 0.64)
  Top 0.254: D1.3.C v24.89,29.72 | v14.73,48.26 12.95,48.26 R1.2.6
  Bottom 0.254: v24.89,29.72 14.73,39.88 v14.73,48.26
N$43  (via drill 0.64)
  Top 0.254: D2.3.C v62.23,29.72 | v52.07,48.26 50.28,48.26 R2.2.6
  Bottom 0.254: v62.23,29.72 52.07,39.88 v52.07,48.26
N$44  (via drill 0.64)
  Top 0.254: D2.4.C v62.23,27.94 | v50.29,45.21 50.29,47.45 R2.2.5
  Bottom 0.254: v62.23,27.94 50.29,39.88 v50.29,45.21
N$45
  Top 0.254: IC3.1.9 31.24,19.05 30.99,19.3 23.88,19.3 23.62,19.56 23.62,21.08 23.37,21.34 J3.1.2 J3.1.1 12.84,18.05 R3.1.16
N$46
  Top 0.254: IC3.1.10 29.97,18.54 29.72,18.8 J3.1.4 J3.1.3 14.22,16.89 14.22,15.24 13.43,14.45 R3.1.15
N$47
  Top 0.254: IC3.1.13 26.16,13.46 25.91,13.21 23.88,13.21 23.62,13.46 23.62,16 23.37,16.26 J3.1.6 J3.1.5 13.52,13.65 R3.1.14
N$48
  Top 0.254: IC3.1.12 27.43,12.95 27.18,12.7 22.99,12.7 J3.1.8 J3.1.7 15.26,12.85 R3.1.13
N$49
  Top 0.254: IC3.1.5 29.97,5.84 29.72,5.59 23.88,5.59 23.62,5.33 23.62,3.81 23.37,3.56 J3.1.16 J3.1.15 12.84,6.85 R3.1.9
N$50
  Top 0.254: IC3.1.4 28.7,6.35 28.45,6.1 J3.1.14 J3.1.13 14.22,8 14.22,9.65 13.43,10.45 R3.1.10
N$51
  Top 0.254: IC3.1.1 24.89,11.43 24.64,11.68 23.88,11.68 23.62,11.43 23.62,8.89 23.37,8.64 J3.1.12 J3.1.11 13.52,11.25 R3.1.11
N$52
  Top 0.254: IC3.1.2 26.16,11.94 25.91,12.19 22.99,12.19 J3.1.10 J3.1.9 15.26,12.05 R3.1.12
N$53
  Top 0.254: J3.2.15 J3.2.13 | J3.2.13 J3.2.14 J3.2.16 | R3.3.5 36.46,8.37 J3.2.13
N$54
  Top 0.254: J3.2.12 J3.2.10 J3.2.9 | J3.2.9 J3.2.11 | R3.3.6 37.87,12.05 J3.2.9
N$55
  Top 0.254: J3.2.4 J3.2.2 J3.2.1 J3.2.3 36.46,16.52 R3.3.8
N$56
  Top 0.254: J3.2.8 J3.2.6 J3.2.5 J3.2.7 37.87,12.85 R3.3.7
N$57  (via drill 0.64)
  Top 0.254: IC3.1.8 v32.51,19.05 | v34.54,19.05 34.54,22.1 34.29,22.35 D3.1.A | 34.53,18.78 v34.54,19.05 | v34.54,19.05 34.54,13.76 R3.3.1
  Bottom 0.254: v32.51,19.05 v34.54,19.05
N$58  (via drill 0.64)
  Top 0.254: IC3.1.11 v28.7,17.53 | D3.2.A 33.27,20.57 33.53,20.32 v33.53,17.53 33.53,13.21 33.78,12.95 34.55,12.95 R3.3.2
  Bottom 0.254: v28.7,17.53 v33.53,17.53
N$59  (via drill 0.64)
  Top 0.254: IC3.1.3 v27.43,7.37 | D3.3.A 33.27,4.32 33.53,4.57 v33.53,7.37 33.53,11.68 33.78,11.94 34.55,11.94 R3.3.3
  Bottom 0.254: v27.43,7.37 v33.53,7.37
N$60  (via drill 0.64)
  Top 0.254: IC3.1.6 v31.24,5.84 | D3.4.A 34.29,2.54 34.54,2.79 v34.54,5.84 34.54,11.13 R3.3.4
  Bottom 0.254: v31.24,5.84 v34.54,5.84
N$61  (via drill 0.64)
  Top 0.254: D3.4.C v24.89,2.54 | v12.95,19.81 12.95,22.05 R3.2.5
  Bottom 0.254: v24.89,2.54 12.95,14.48 v12.95,19.81
N$62  (via drill 0.64)
  Top 0.254: D3.3.C v24.89,4.32 | v14.73,22.86 12.95,22.86 R3.2.6
  Bottom 0.254: v24.89,4.32 14.73,14.48 v14.73,22.86
N$63
  Top 0.254: R3.2.7 23.98,23.77 24.13,23.62 24.13,20.83 24.38,20.57 D3.2.C
N$64
  Top 0.254: R3.2.8 24.45,24.57 24.64,24.38 24.64,22.61 24.89,22.35 D3.1.C
N$65
  Top 0.254: IC4.1.9 68.58,19.05 68.33,19.3 61.21,19.3 60.96,19.56 60.96,21.08 60.71,21.34 J4.1.2 J4.1.1 50.18,18.05 R4.1.16
N$66
  Top 0.254: IC4.1.10 67.31,18.54 67.06,18.8 J4.1.4 J4.1.3 51.56,16.89 51.56,15.24 50.77,14.45 R4.1.15
N$67
  Top 0.254: IC4.1.13 63.5,13.46 63.25,13.21 61.21,13.21 60.96,13.46 60.96,16 60.71,16.26 J4.1.6 J4.1.5 50.86,13.65 R4.1.14
N$68
  Top 0.254: IC4.1.12 64.77,12.95 64.52,12.7 60.33,12.7 J4.1.8 J4.1.7 52.6,12.85 R4.1.13
N$69
  Top 0.254: IC4.1.5 67.31,5.84 67.06,5.59 61.21,5.59 60.96,5.33 60.96,3.81 60.71,3.56 J4.1.16 J4.1.15 50.18,6.85 R4.1.9
N$70
  Top 0.254: IC4.1.4 66.04,6.35 65.79,6.1 J4.1.14 J4.1.13 51.56,8 51.56,9.65 50.77,10.45 R4.1.10
N$71
  Top 0.254: IC4.1.1 62.23,11.43 61.98,11.68 61.21,11.68 60.96,11.43 60.96,8.89 60.71,8.64 J4.1.12 J4.1.11 50.86,11.25 R4.1.11
N$72
  Top 0.254: IC4.1.2 63.5,11.94 63.25,12.19 60.33,12.19 J4.1.10 J4.1.9 52.6,12.05 R4.1.12
N$73
  Top 0.254: J4.2.15 J4.2.13 | J4.2.13 J4.2.14 J4.2.16 | R4.3.5 73.8,8.37 J4.2.13
N$74
  Top 0.254: J4.2.11 J4.2.9 | J4.2.9 J4.2.10 J4.2.12 | R4.3.6 75.2,12.05 J4.2.9
N$75
  Top 0.254: J4.2.4 81.28,18.92 81.28,21.34 J4.2.2 J4.2.1 J4.2.3 73.8,16.52 R4.3.8
N$76
  Top 0.254: J4.2.8 J4.2.6 J4.2.5 J4.2.7 75.2,12.85 R4.3.7
N$77  (via drill 0.64)
  Top 0.254: IC4.1.8 v69.85,19.05 | v71.88,19.05 71.88,22.1 71.63,22.35 D4.1.A | 71.87,18.78 v71.88,19.05 | v71.88,19.05 71.88,13.76 R4.3.1
  Bottom 0.254: v69.85,19.05 v71.88,19.05
N$78  (via drill 0.64)
  Top 0.254: IC4.1.11 v66.04,17.53 | D4.2.A 70.61,20.57 70.87,20.32 v70.87,17.53 70.87,13.21 71.12,12.95 71.89,12.95 R4.3.2
  Bottom 0.254: v66.04,17.53 v70.87,17.53
N$79  (via drill 0.64)
  Top 0.254: IC4.1.3 v64.77,7.37 | D4.3.A 70.61,4.32 70.87,4.57 v70.87,7.37 70.87,11.68 71.12,11.94 71.89,11.94 R4.3.3
  Bottom 0.254: v64.77,7.37 v70.87,7.37
N$80  (via drill 0.64)
  Top 0.254: IC4.1.6 v68.58,5.84 | D4.4.A 71.63,2.54 71.88,2.79 v71.88,5.84 71.88,11.13 R4.3.4
  Bottom 0.254: v68.58,5.84 v71.88,5.84
N$81
  Top 0.254: R4.2.8 61.79,24.57 61.98,24.38 61.98,22.61 62.23,22.35 D4.1.C
N$82
  Top 0.254: R4.2.7 61.32,23.77 61.47,23.62 61.47,20.83 61.72,20.57 D4.2.C
N$83  (via drill 0.64)
  Top 0.254: D4.3.C v62.23,4.32 | v52.07,22.86 50.32,22.86 R4.2.6
  Bottom 0.254: v62.23,4.32 52.07,14.48 v52.07,22.86
N$84  (via drill 0.64)
  Top 0.254: D4.4.C v62.23,2.54 | v50.29,19.81 50.29,22.03 R4.2.5
  Bottom 0.254: v62.23,2.54 50.29,14.48 v50.29,19.81
N$85
  Top 0.254: RO.2.1 68.7,76.81 DO.1.C
N$86
  Top 0.254: RO.2.2 67.93,67.71 66.55,69.09 DO.2.C
N$87
  Top 0.254: RO.2.3 67.93,66.91 66.55,65.53 DO.3.C
N$88
  Top 0.254: RO.2.4 68.7,57.81 DO.4.C
N$89
  Top 0.254: JO.1.4 JO.1.2 | JO.1.2 JO.1.1 JO.1.3 56.27,71.39 RO.1.8 | JO.1.2 64.39,78.9 DO.1.A
N$90
  Top 0.254: JO.1.8 JO.1.6 | JO.1.6 JO.1.5 JO.1.7 57.68,67.71 RO.1.7 | JO.1.6 64.39,71.28 DO.2.A
N$91
  Top 0.254: JO.1.9 JO.1.11 | JO.1.9 JO.1.10 JO.1.12 64.39,63.34 DO.3.A | RO.1.6 57.68,66.91 JO.1.9
N$92
  Top 0.254: JO.1.13 JO.1.15 | JO.1.13 JO.1.14 JO.1.16 64.39,55.72 DO.4.A | RO.1.5 56.27,63.23 JO.1.13
N$93
  Top 0.406: 79.5,68.71 CP.1.1 79.63,68.07 | 79.63,68.07 79.63,65.98 CP.2.1 79.63,65.08 FP.1.1 | USB.1 79.53,75.66 JP.2.2 JP.2.1 79.76,68.2 79.63,68.07
N$94
  Top 0.254: SI.2.4 SI.2.3 19.06,73.44 DI.2.A 20.86,73.41 23.88,73.41 25.91,71.37 25.91,68.07 26.27,67.71 RI.3.2
N$95
  Top 0.254: SI.3.3 SI.3.4 19.06,61.18 DI.3.A 20.86,61.21 23.88,61.21 25.91,63.25 25.91,66.55 26.27,66.91 RI.3.3
N$96
  Top 0.254: SI.1.4 SI.1.3 19.06,81.06 DI.1.A 27.04,74.85 RI.3.1
N$97
  Top 0.254: SI.4.3 SI.4.4 19.06,53.56 DI.4.A 27.04,59.77 RI.3.4
N$98  (via drill 0.64)
  Top 0.254: v22.86,70.87 22.86,68.63 RI.2.1 | DI.1.C 20.83,78.49 v22.86,76.45
  Bottom 0.254: v22.86,76.45 v22.86,70.87
N$99
  Top 0.254: RI.2.2 22.21,67.71 20.83,69.09 DI.2.C
N$100
  Top 0.254: RI.2.3 22.21,66.91 20.83,65.53 DI.3.C
N$101  (via drill 0.64)
  Top 0.254: v22.86,63.75 22.86,65.99 RI.2.4 | DI.4.C 20.83,56.13 v22.86,58.17
  Bottom 0.254: v22.86,58.17 v22.86,63.75
N$102
  Top 0.305: DP.1.C 80.57,60.74 RP.1.2
N$104  (via drill 0.64)
  other vias: 76.71,51.56

### Text on the board
tPlace: GND | 5V | x NAND y | input / group | constant / group | output / group | power / group | x | y | NAND group #1 | NAND group #2 | http://www.github.com/danpage/nandboard | nandboard / rev. E.2 | NAND group #3 | NAND group #4 | y | y | AND | NAND | x | y | x | x | 0 | 0 | 0 | 1 | 0 | 1 | 0 | 1 | 1 | 0 | 0 | 1 | 1 | 1 | 1 | 0